# Altium schematic sheet Power_USB.SchDoc
size A; SheetNumber: 1; SheetTotal: 6
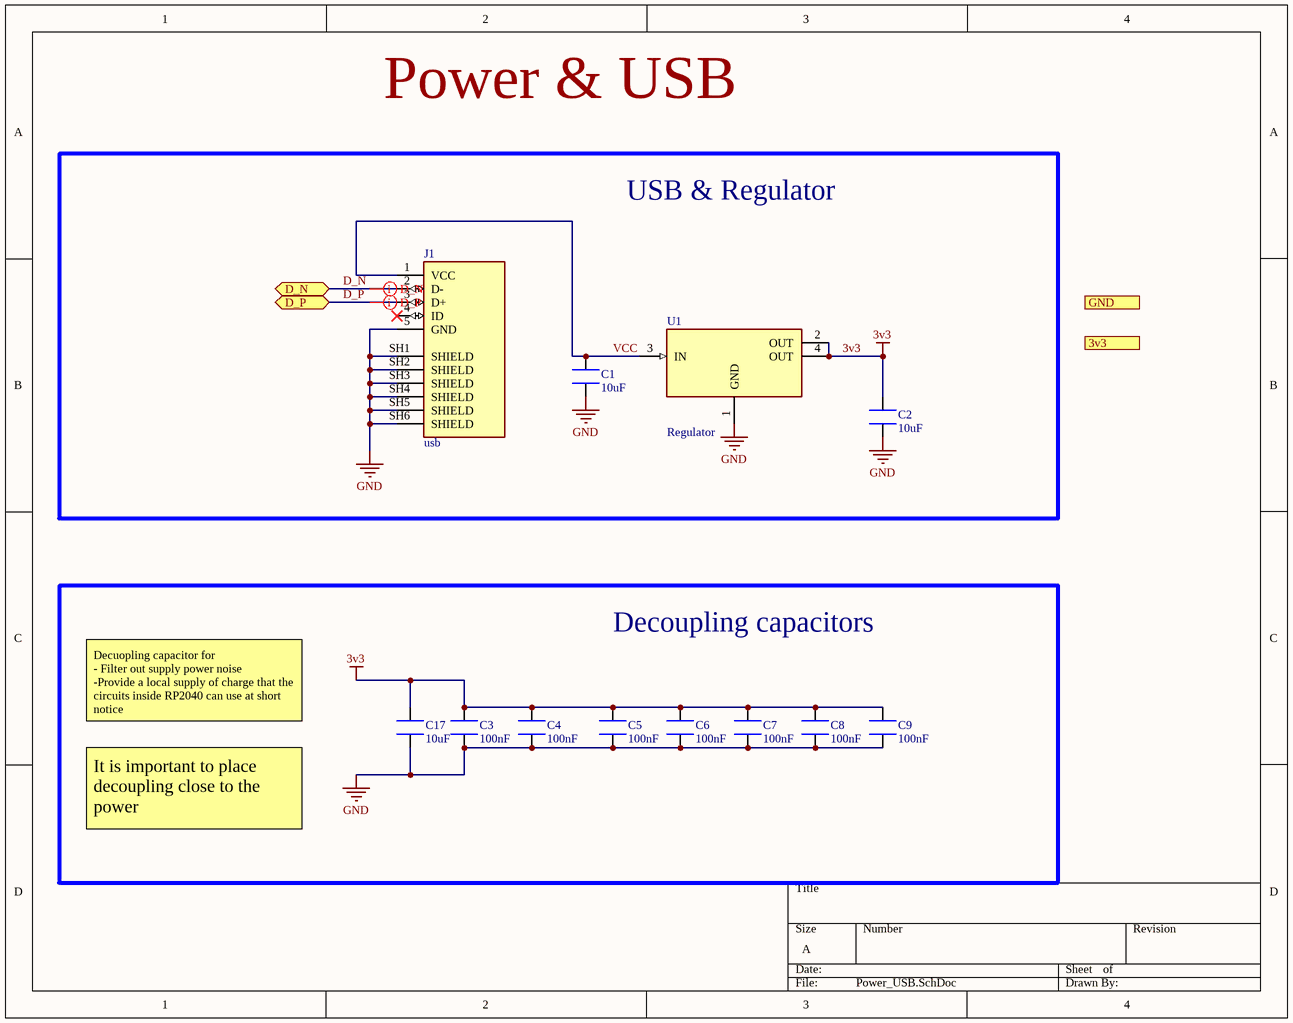
[diagram p0: Power_USB.SchDoc]

## Parts
C1  10uF  [CL21A106KOQNNNG]
C2  10uF  [CL21A106KOQNNNG]
C3  100nF  [CL10B104KB8NNNC]
C4  100nF  [CL10B104KB8NNNC]
C5  100nF  [CL10B104KB8NNNC]
C6  100nF  [CL10B104KB8NNNC]
C7  100nF  [CL10B104KB8NNNC]
C8  100nF  [CL10B104KB8NNNC]
C9  100nF  [CL10B104KB8NNNC]
C17  10uF  [CL21A106KOQNNNG]
J1  usb  [AMPHENOL_10118194-0001LF]
U1  Regulator  [SOT230P700X180-4N]

## Blocks framed on the sheet
USB & Regulator: C1 C2 J1 U1
Decoupling capacitors: C3-C9 C17

## Ports
3v3, D_N (bidir), D_P (bidir), GND

## Nets
3v3: C2.2 C3.2 C4.2 C5.2 C6.2 C7.2 C8.2 C9.2 C17.2 U1.2(OUT) U1.4(OUT)
GND: C1.1 C2.1 C3.1 C4.1 C5.1 C6.1 C7.1 C8.1 C9.1 C17.1 J1.5(GND) J1.SH1(SHIELD) J1.SH2(SHIELD) J1.SH3(SHIELD) J1.SH4(SHIELD) J1.SH5(SHIELD) J1.SH6(SHIELD) U1.1(GND)
D_N: J1.2(D-) ; port D_N
D_P: J1.3(D+) ; port D_P
VCC: C1.2 J1.1(VCC) U1.3(IN)

Not connected (* = marked no-connect by the designer): J1 4(ID)*

## Layout directives
differential pair; differential pair class Diff90: D_N, D_P

## Notes on the sheet
- Power & USB
- 90 ohm deffrential imbedance for  USB
- Decuopling capacitor for
  - Filter out supply power noise
  -Provide a local supply of charge that the circuits inside RP2040 can use at short notice
- It is important to place decoupling close to the power
  pins

## Library data of the parts
C1 C2 C17 = CL21A106KOQNNNG: SMD ceramic capacitor 10µF, tolerance±10% 16V  X5R 0805 _2012 Metric; MF: Samsung Electro-Mechanics; Package: 0805 Samsung; Digi-Key_Part_Number: 1276-6455-1-ND; Digi-Key_Purchase_URL: https://www.digikey.com/product-detail/en/samsung-electro-mechanics/CL21A106KOQNNNG/1276-6455-1-ND/5958083?utm_source=snapeda&utm_medium=aggregator&utm_campaign=symbol; Value: *; MP: CL21A106KOQNNNG; SnapEDA_Link: https://www.snapeda.com/parts/CL21A106KOQNNNG/Samsung%20Electro-Mechanics/view-part/3597829/?ref=snap
C3-C9 = CL10B104KB8NNNC: SMD ceramic capacitor 0.1µF, tolerance ±10% 50V 0603 _1608 Metric_; MF: Samsung Electro-Mechanics; Price: None; MP: CL10B104KB8NNNC; SnapEDA_Link: https://www.snapeda.com/parts/CL10B104KB8NNNC/Samsung%20Electro-Mechanics/view-part/3598309/?ref=snap; Availability: Unavailable; Package: 0603 Samsung; Value: *
J1 = 10118194-0001LF: Micro USB, Input Output Connectors, B TYPE RECEPTACLE with flange; MF: Amphenol ICC; SnapEDA_Link: https://www.snapeda.com/parts/10118194-0001LF/Amphenol+FCI/view-part/?ref=snap; Package: None; Value: *; MP: 10118194-0001LF; Check_prices: https://www.snapeda.com/parts/10118194-0001LF/Amphenol+FCI/view-part/?ref=eda
U1 = NCP1117ST50T3G: Linear Voltage Regulator IC 1 Output 1A SOT-223; MF: ON Semiconductor; MP: NCP1117ST50T3G; Package: TO-261-4 ON Semiconductor; Price: None; Value: *; SnapEDA_Link: https://www.snapeda.com/parts/NCP1117ST50T3G/ON%20Semiconductor/view-part/836318/?ref=snap; Availability: Unavailable